# EAGLE design BatBoostAAA (EAGLE 7.0.0)
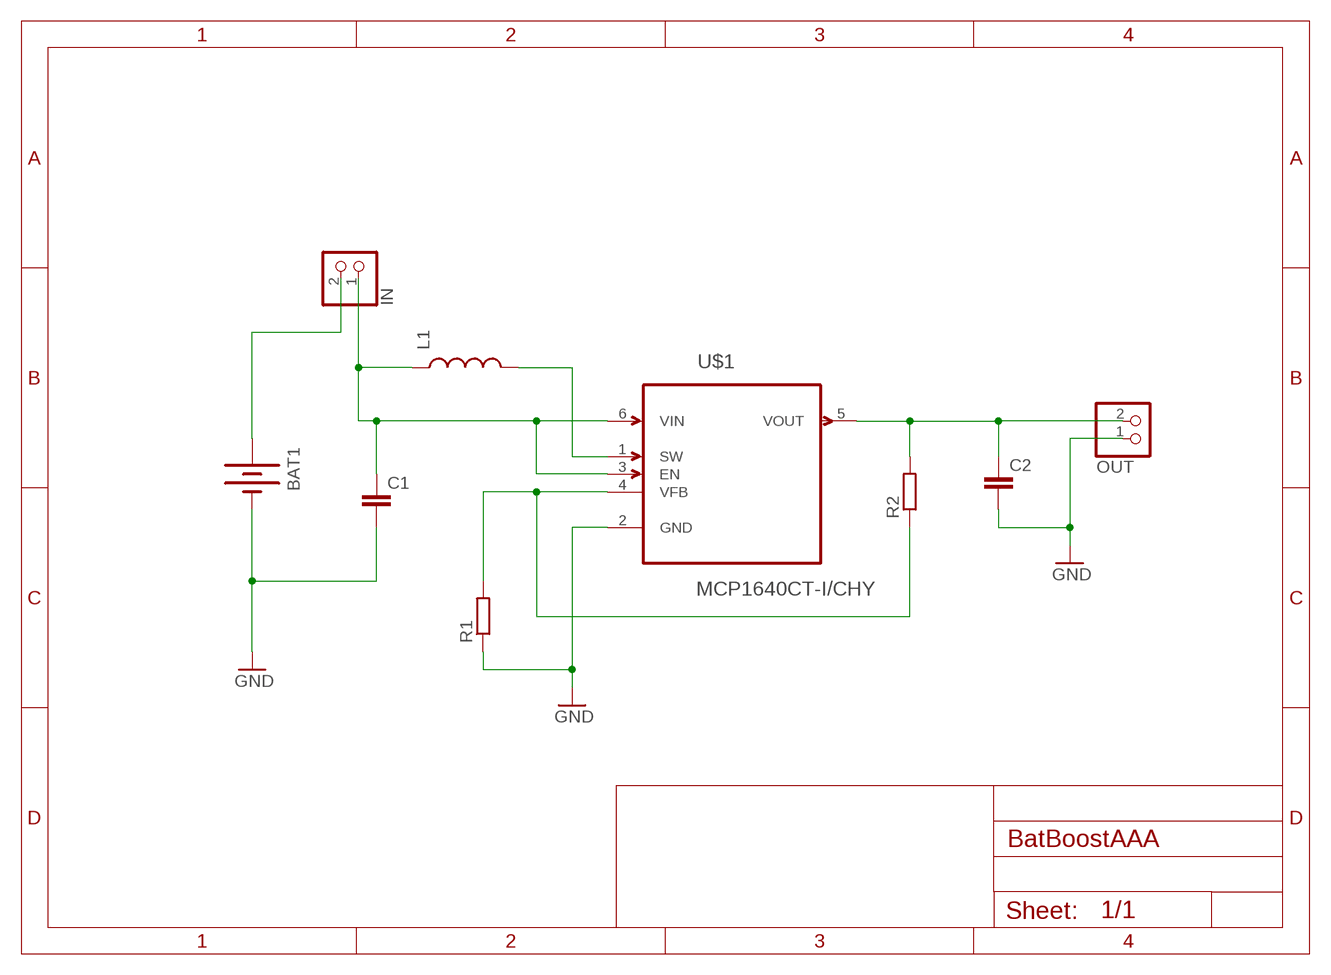
[diagram p0: schematic, sheet 1]

## Parts
BAT1  BATTERYAAA  [BATTERY-AAA]
C1  C-EUC0805K  [C0805K]
C2  C-EUC0805K  [C0805K]
IN  PINHD-1X2  [1X02]
L1  INDUCTOR1210  [LQH32]
OUT  PINHD-1X2  [1X02]
R1  R-EU_R0603  [R0603]
R2  R-EU_R0603  [R0603]
U$1  MCP1640CT-I/CHY  [SOT95P270X145-6N]

## Nets
GND: BAT1.GND@1(-) C1.2 C2.2 OUT.1 R1.1 U$1.2(GND)
N$1: C1.1 IN.1 L1.1 U$1.3(EN) U$1.6(VIN)
N$2: C2.1 OUT.2 R2.2 U$1.5(VOUT)
N$3: R1.2 R2.1 U$1.4(VFB)
N$4: L1.2 U$1.1(SW)
N$5: BAT1.PWR@1(+) IN.2

## Library data of the parts
BAT1 = SparkFun:BATTERY: Battery Holders Various common sizes : AA, AAA, 20mm coin cell and 12mm coin cell.
C1 C2 = rcl:C-EU: CAPACITOR, European symbol
IN OUT = pinhead:PINHD-1X2: PIN HEADER
L1 = inductor:INDUCTOR: Inductors Basic Inductor/Choke - 0603 and 1206. Footprints are not proven and vary greatly between part numbers.
R1 R2 = rcl:R-EU_: RESISTOR, European symbol
U$1 = MCP1640:MCP1640CT-I/CHY: Synchronous Boost Regulator; MPN: MCP1640CT-I/CHY; OC_FARNELL: 1800208; OC_NEWARK: 73R3626; PACKAGE: SOT-6; SUPPLIER: Microchip

## Board
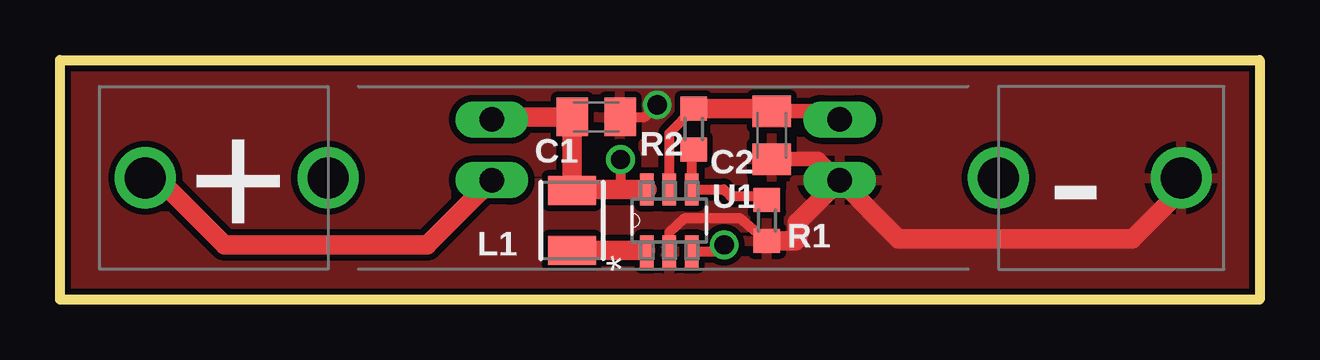
[diagram p1: board, top side]
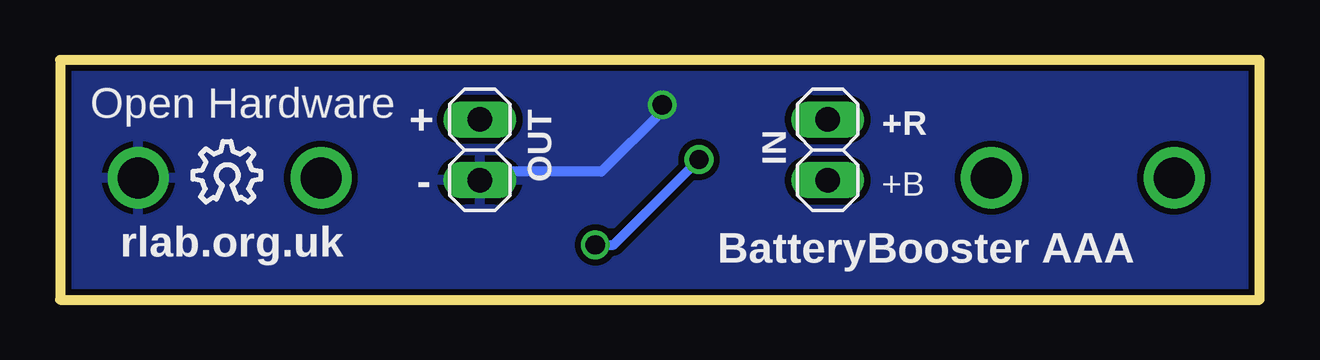
[diagram p2: board, bottom side, seen from below]

Size 50 x 10 mm. Coordinates in mm from the lower left corner, seen from the top.
Outline: 0,0 0,10 50,10 50,0 0,0
Copper layers (1*16): Top 0.035mm / dielectric 1.5mm / Bottom 0.035mm
Design rules "SeeedStudio_2layer_DRU_no_angle_20140221 *": minimum track width 6mil, minimum drill 12mil, track to track 10mil, track to pad 10mil, pad to pad 10mil, via to via 10mil, smd to smd 0mil, copper to edge 10mil, drill to drill 10mil, minimum pad ring 10mil, minimum via ring 6mil, stop-mask expansion 2mil, vias tented up to drill 100mil, thermal gap 10mil

### Footprints (pad centres in the part's own frame; a part is rotated, then mirrored left to right if it is on the bottom)
BATTERY-AAA = drill 1.702: GND@1 21.59,0; GND@2 13.97,0; PWR@1 -21.59,0; PWR@2 -13.97,0
C0805K = smd 1.3 x 1.6: 1 -1,0; 2 1,0
1X02 = drill 1.016 long: 1 -1.27,0; 2 1.27,0
LQH32 = smd 1.2 x 2: 1 -1.25,0; 2 1.25,0
R0603 = smd 1 x 1.1: 1 -0.85,0; 2 0.85,0
SOT95P270X145-6N = smd 1.321 x 0.559: 1 -1.295,0.94; 2 -1.295,0; 3 -1.295,-0.94; 4 1.295,-0.94; 5 1.295,0; 6 1.295,0.94

### Placement (x,y rotation side)
BAT1  25.15,5.08 0 top
C1  22.35,7.62 0 top
C2  29.67,6.86 270 top
IN  18,6.25 270 bottom
L1  21.34,3.3 270 top
OUT  32.5,6.25 90 bottom
R1  29.46,3.3 90 top
R2  26.42,7.11 90 top
U$1  25.4,3.3 90 top
U$2  [OSHW_8X100_NOTEXT]  44.45,4.06 0 bottom

### Tracks (layer width: path | path; a pad name or v marks a point on that pad's centre or on a via)
GND  (via drill 0.8)
  Top 0.406: 29.88,2.45 R1.1 28.34,3.4 26.06,3.4 25.4,2.79 U$1.2 | C2.2 29.46,5.84 | C1.2 24.38,7.62 v24.89,8.13
  Top 0.61: C2.2 31.62,5.86 OUT.1
  Top 0.813: 29.88,2.45 30.65,2.45 30.73,2.54 30.73,3.21 OUT.1 34.94,2.54 44.7,2.54 46.74,4.57 BAT1.GND@1
  Bottom 0.406: v24.89,8.13 24.89,7.87 27.43,5.33 32.15,5.33 OUT.1
  pour Bottom: 0,0 0,10 50,10 50,0
  pour Top: 0,0 0,10 50,10 50,0
N$1  (via drill 0.8)
  Top 0.406: U$1.3 27.41,2.01 v27.69,2.29 | v23.37,5.84 23.37,4.85 23.11,4.6
  Top 0.813: U$1.6 23.11,4.6 21.38,4.6 L1.1 21.34,7.6 C1.1 18.1,7.62 IN.1
  Bottom 0.406: v27.69,2.29 26.92,2.29 v23.37,5.84
N$2
  Top 0.406: U$1.5 25.4,6.95 R2.2 | 29.36,7.96 C2.1
  Top 0.61: C2.1 32.16,7.86 OUT.2
  Top 0.813: R2.2 29.36,7.96
N$3
  Top 0.406: R2.1 26.34,6.19 U$1.4 27.66,4.6 27.94,4.32 29.3,4.32 R1.2
N$4
  Top 0.406: 24.41,2.05 U$1.1
  Top 0.813: L1.2 24.41,2.05
N$5
  Top 0.813: BAT1.PWR@1 4.06,5.08 6.86,2.29 15.31,2.29 IN.2

### Text on the board
tNames: U1
bNames: Open Hardware | +R | + | +B | - | BatteryBooster AAA | rlab.org.uk